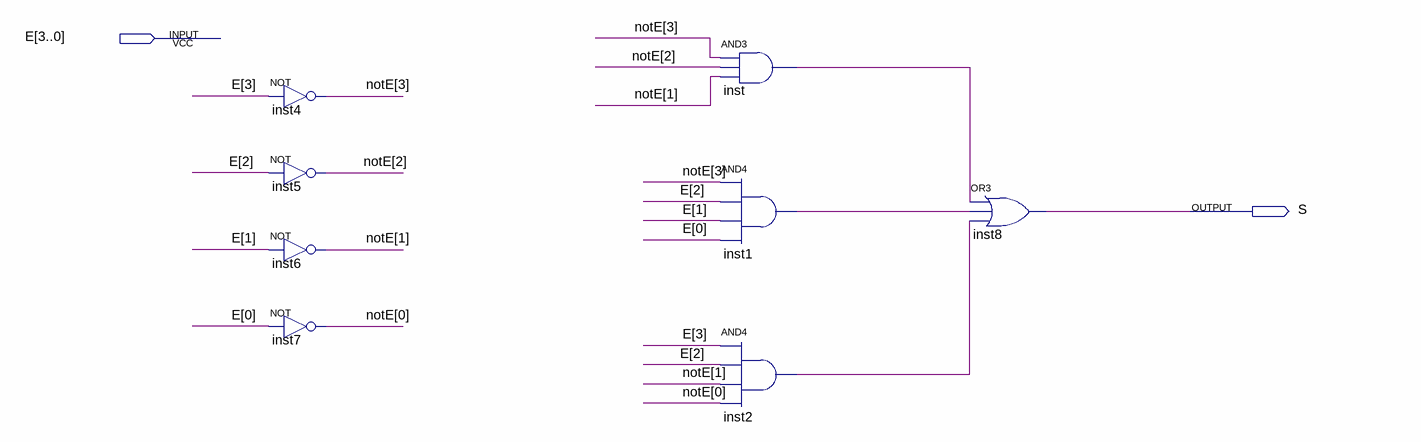
[diagram p0: schematic sheet]
// Quartus schematic segG.bdf as structural Verilog: 8 symbols, 2 pins
module segG (
  input  [3:0] E,
  output S
);

  wire inst1_out, inst2_out, inst_out;
  wire [3:0] notE;

  not inst4 (notE[3], E[3]);
  not inst5 (notE[2], E[2]);
  not inst6 (notE[1], E[1]);
  not inst7 (notE[0], E[0]);
  and inst (inst_out, notE[3], notE[2], notE[1]);
  and inst1 (inst1_out, notE[3], E[2], E[1], E[0]);
  and inst2 (inst2_out, E[3], E[2], notE[1], notE[0]);
  or inst8 (S, inst_out, inst1_out, inst2_out);
endmodule
